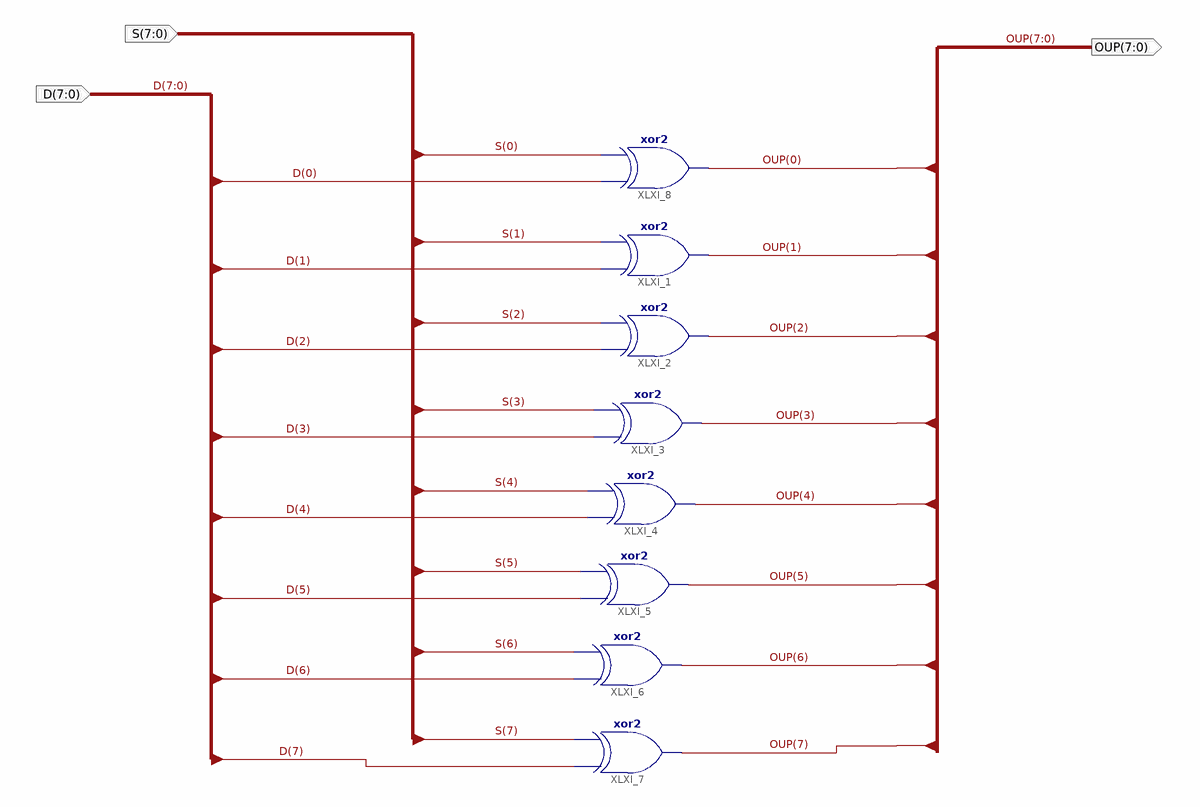
[diagram p0: schematic sheet 1]
// Xilinx ISE schematic CATEXOR.sch (spartan6) as structural Verilog: 8 symbols, 3 ports
module CATEXOR (
  input  [7:0] S,
  input  [7:0] D,
  output [7:0] OUP
);

  xor XLXI_1 (OUP[1], D[1], S[1]);
  xor XLXI_2 (OUP[2], D[2], S[2]);
  xor XLXI_3 (OUP[3], D[3], S[3]);
  xor XLXI_4 (OUP[4], D[4], S[4]);
  xor XLXI_5 (OUP[5], D[5], S[5]);
  xor XLXI_6 (OUP[6], D[6], S[6]);
  xor XLXI_7 (OUP[7], D[7], S[7]);
  xor XLXI_8 (OUP[0], D[0], S[0]);
endmodule
